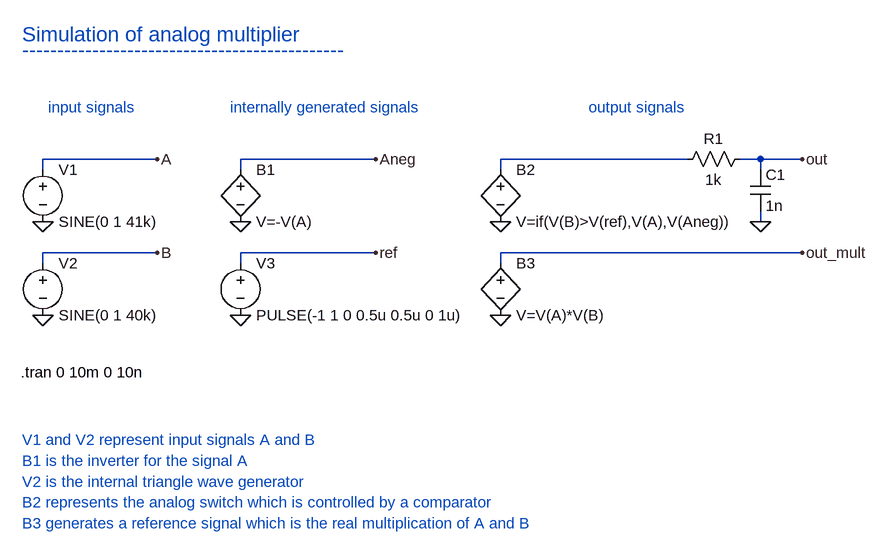
[diagram p0: schematic ideal_mult.asc]
ideal_mult.asc, the LTspice schematic file:
Version 4
SHEET 1 1716 680
WIRE 592 32 416 32
WIRE 928 32 720 32
WIRE 1408 32 1120 32
WIRE 1520 32 1488 32
WIRE 1584 32 1520 32
WIRE 416 48 416 32
WIRE 720 48 720 32
WIRE 1120 48 1120 32
WIRE 1520 48 1520 32
WIRE 1520 128 1520 112
WIRE 592 176 416 176
WIRE 928 176 720 176
WIRE 1584 176 1120 176
WIRE 416 192 416 176
WIRE 720 192 720 176
WIRE 1120 192 1120 176
FLAG 416 128 0
FLAG 416 272 0
FLAG 592 32 A
FLAG 592 176 B
FLAG 720 128 0
FLAG 720 272 0
FLAG 928 176 ref
FLAG 928 32 Aneg
FLAG 1120 128 0
FLAG 1120 272 0
FLAG 1584 32 out
FLAG 1584 176 out_mult
FLAG 1520 128 0
SYMBOL voltage 416 32 R0
WINDOW 123 0 0 Left 2
WINDOW 39 0 0 Left 2
SYMATTR InstName V1
SYMATTR Value SINE(0 1 41k)
SYMBOL voltage 416 176 R0
WINDOW 123 0 0 Left 2
WINDOW 39 0 0 Left 2
SYMATTR InstName V2
SYMATTR Value SINE(0 1 40k)
SYMBOL bv 720 32 R0
SYMATTR InstName B1
SYMATTR Value V=-V(A)
SYMBOL voltage 720 176 R0
WINDOW 123 0 0 Left 2
WINDOW 39 0 0 Left 2
SYMATTR InstName V3
SYMATTR Value PULSE(-1 1 0 0.5u 0.5u 0 1u)
SYMBOL bv 1120 32 R0
SYMATTR InstName B2
SYMATTR Value V=if(V(B)>V(ref),V(A),V(Aneg))
SYMBOL bv 1120 176 R0
SYMATTR InstName B3
SYMATTR Value V=V(A)*V(B)
SYMBOL res 1392 48 R270
WINDOW 0 32 56 VTop 2
WINDOW 3 0 56 VBottom 2
SYMATTR InstName R1
SYMATTR Value 1k
SYMBOL cap 1504 48 R0
SYMATTR InstName C1
SYMATTR Value 1n
TEXT 424 -48 Left 2 ;input signals
TEXT 704 -48 Left 2 ;internally generated signals
TEXT 1256 -48 Left 2 ;output signals
TEXT 382 360 Left 2 !.tran 0 10m 0 10n
TEXT 384 -160 Left 3 ;Simulation of analog multiplier
TEXT 384 464 Left 2 ;V1 and V2 represent input signals A and B
TEXT 384 496 Left 2 ;B1 is the inverter for the signal A
TEXT 384 528 Left 2 ;V2 is the internal triangle wave generator
TEXT 384 560 Left 2 ;B2 represents the analog switch which is controlled by a comparator
TEXT 384 592 Left 2 ;B3 generates a reference signal which is the real multiplication of A and B
TEXT 384 -136 Left 3 ;----------------------------------------------

The netlist it stands for:
* ideal_mult.asc
V1 A 0 SINE(0 1 41k)
V2 B 0 SINE(0 1 40k)
B1 Aneg 0 V=-V(A)
V3 ref 0 PULSE(-1 1 0 0.5u 0.5u 0 1u)
B2 N001 0 V=if(V(B)>V(ref),V(A),V(Aneg))
B3 out_mult 0 V=V(A)*V(B)
R1 N001 out 1k
C1 out 0 1n
* input signals
* internally generated signals
* output signals
.tran 0 10m 0 10n
* Simulation of analog multiplier
* V1 and V2 represent input signals A and B
* B1 is the inverter for the signal A
* V2 is the internal triangle wave generator
* B2 represents the analog switch which is controlled by a comparator
* B3 generates a reference signal which is the real multiplication of A and B
* ----------------------------------------------
.backanno
.end